# Altium schematic sheet Top.SchDoc: DEFAULT
size B; CheckedBy: CHECKER; Author: AUTHOR; Revision: A; SheetNumber: 1; SheetTotal: 11; PartNumber: 123
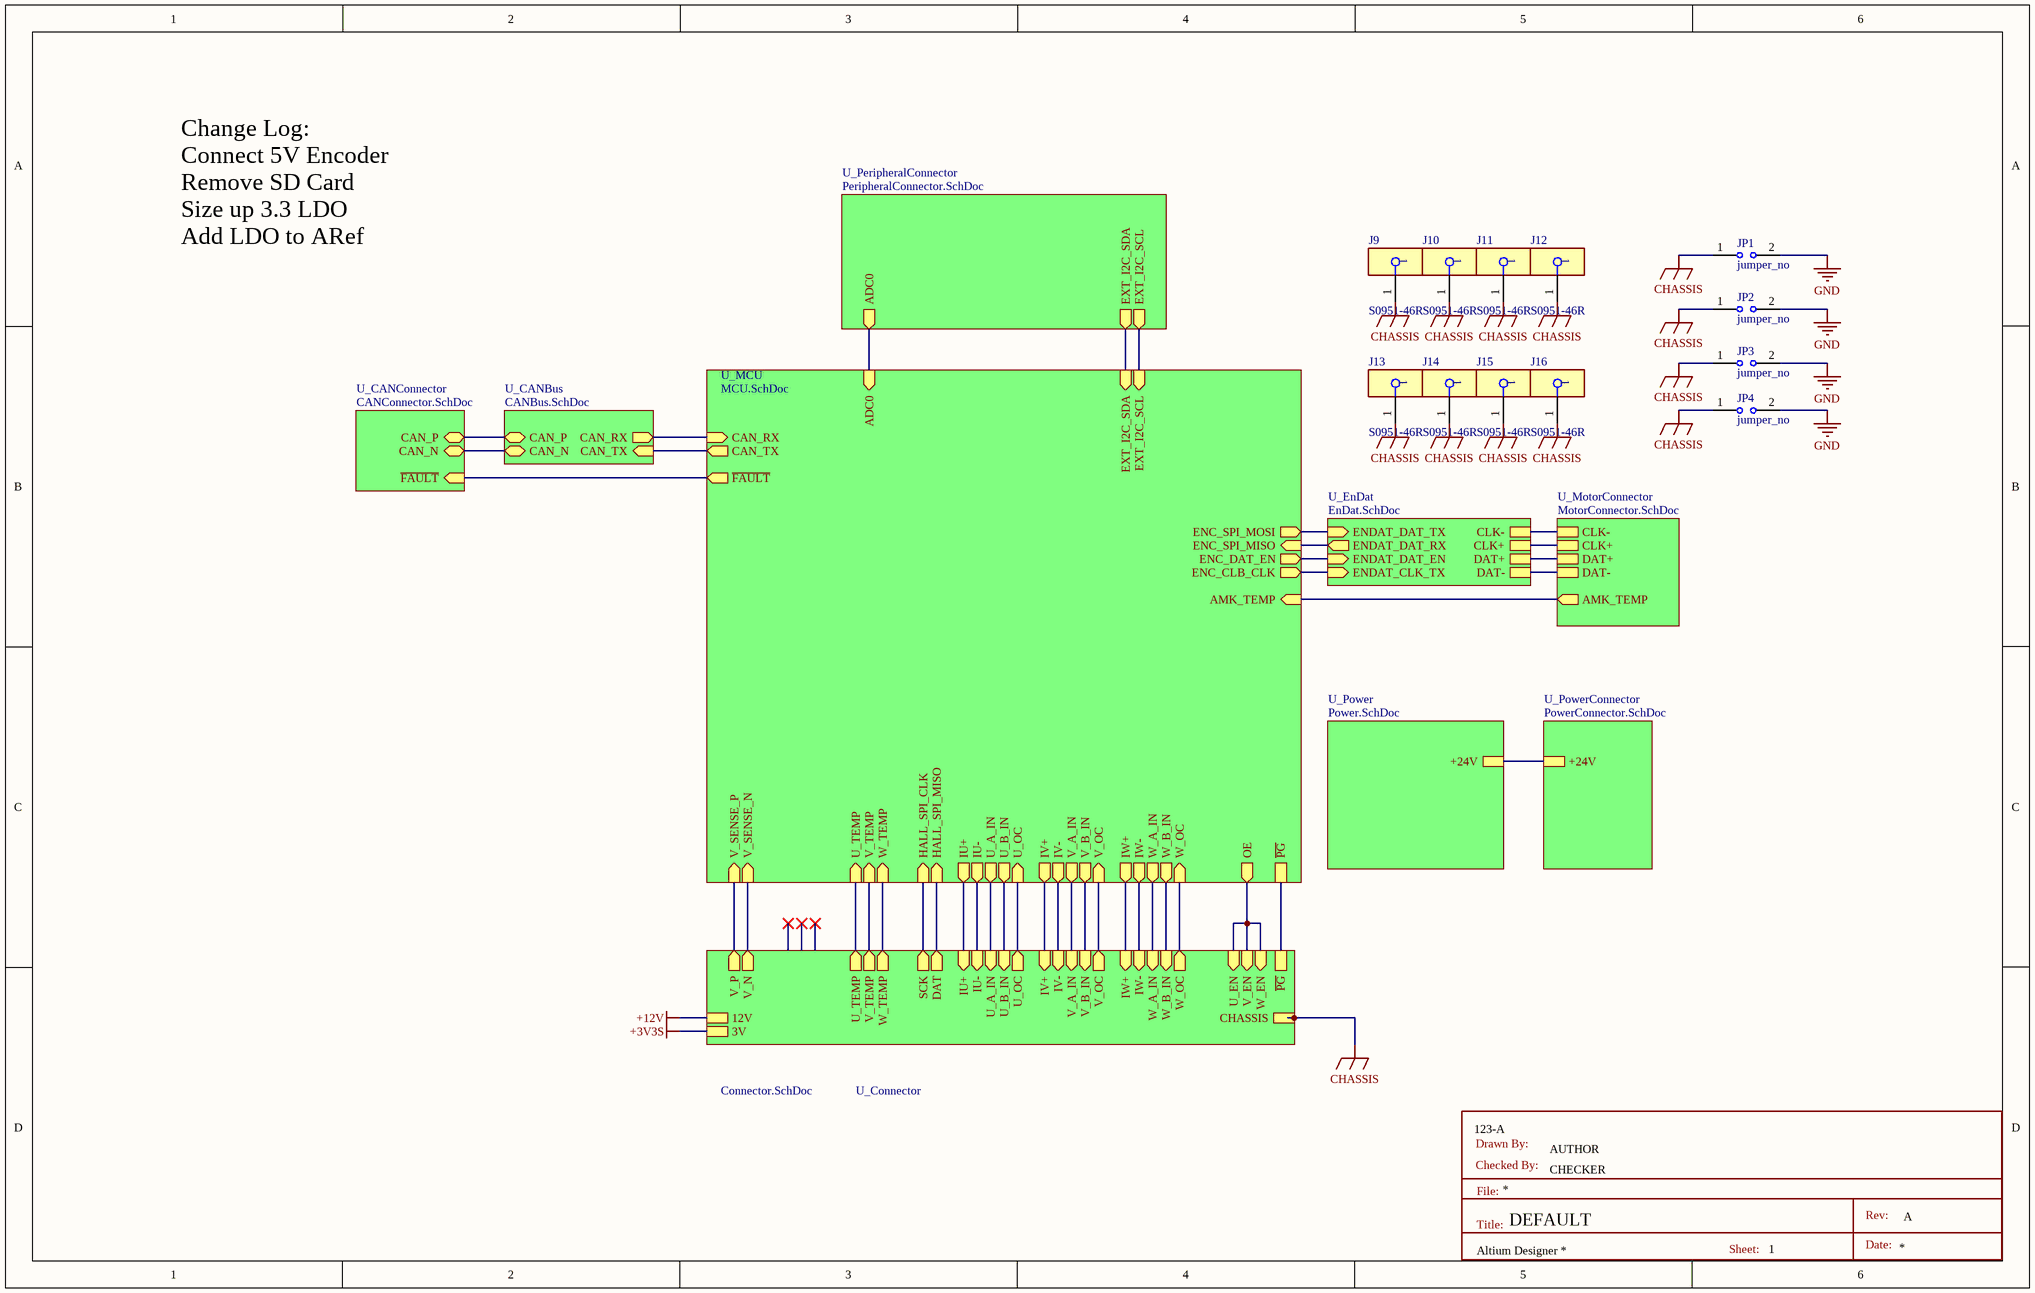
[diagram p0: Top.SchDoc]

## Parts
J9  S0951-46R  [FP-S0951-46R-MFG]
J10  S0951-46R  [FP-S0951-46R-MFG]
J11  S0951-46R  [FP-S0951-46R-MFG]
J12  S0951-46R  [FP-S0951-46R-MFG]
J13  S0951-46R  [FP-S0951-46R-MFG]
J14  S0951-46R  [FP-S0951-46R-MFG]
J15  S0951-46R  [FP-S0951-46R-MFG]
J16  S0951-46R  [FP-S0951-46R-MFG]
JP1  jumper_no  [jumper_no]
JP2  jumper_no  [jumper_no]
JP3  jumper_no  [jumper_no]
JP4  jumper_no  [jumper_no]

## Sub-sheets
U_CANBus = CANBus.SchDoc: CAN_TX (in), CAN_RX (out), CAN_P (bidir), CAN_N (bidir)
U_CANConnector = CANConnector.SchDoc: CAN_P (bidir), CAN_N (bidir), ~{FAULT} (in)
U_Connector = Connector.SchDoc: U_B_IN (in), U_A_IN (in), U_EN (in), U_OC (out), V_A_IN (in), V_B_IN (in), V_EN (in), V_OC (out), W_EN (in), W_OC (out), W_A_IN (in), W_B_IN (in), V_N (out), V_P (out), W_TEMP (out), V_TEMP (out), U_TEMP (out), 3V, 12V, CHASSIS, SCK (out), DAT (out), ~{PG}, IU+ (in), IU- (in), IV+ (in), IV- (in), IW+ (in), IW- (in)
U_EnDat = EnDat.SchDoc: CLK-, CLK+, DAT+, DAT-, ENDAT_DAT_RX (out), ENDAT_DAT_EN (in), ENDAT_DAT_TX (in), ENDAT_CLK_TX (in)
U_MCU = MCU.SchDoc: ENC_SPI_MOSI (out), ENC_SPI_MISO (in), HALL_SPI_MISO (in), HALL_SPI_CLK (in), EXT_I2C_SCL (in), EXT_I2C_SDA (in), CAN_RX (in), CAN_TX (out), V_A_IN (out), V_B_IN (out), V_OC (in), V_TEMP (in), U_A_IN (out), U_B_IN (out), U_OC (in), U_TEMP (in), W_A_IN (out), W_B_IN (out), W_OC (in), W_TEMP (in), AMK_TEMP (in), ENC_DAT_EN (out), ENC_CLB_CLK (out), V_SENSE_P (in), V_SENSE_N (in), OE (out), ~{FAULT} (out), ADC0 (in), ~{PG}, IU- (out), IW- (out), IU+ (out), IV+ (out), IW+ (out), IV- (out)
U_MotorConnector = MotorConnector.SchDoc: AMK_TEMP (out), CLK-, CLK+, DAT+, DAT-
U_PeripheralConnector = PeripheralConnector.SchDoc: EXT_I2C_SCL (out), EXT_I2C_SDA (out), ADC0 (out)
U_Power = Power.SchDoc: +24V
U_PowerConnector = PowerConnector.SchDoc: +24V

## Nets
+3V3S: sheet U_Connector/3V
+12V: sheet U_Connector/12V
CHASSIS: J9.1 J10.1 J11.1 J12.1 J13.1 J14.1 J15.1 J16.1 JP1.1 JP2.1 JP3.1 JP4.1 ; sheet U_Connector/CHASSIS
GND: JP1.2 JP2.2 JP3.2 JP4.2
(unnamed): sheet U_MCU/ENC_SPI_MOSI, sheet U_EnDat/ENDAT_DAT_TX
(unnamed): sheet U_MCU/ENC_SPI_MISO, sheet U_EnDat/ENDAT_DAT_RX
(unnamed): sheet U_MCU/HALL_SPI_MISO, sheet U_Connector/DAT
(unnamed): sheet U_MCU/HALL_SPI_CLK, sheet U_Connector/SCK
(unnamed): sheet U_MCU/EXT_I2C_SCL, sheet U_PeripheralConnector/EXT_I2C_SCL
(unnamed): sheet U_MCU/EXT_I2C_SDA, sheet U_PeripheralConnector/EXT_I2C_SDA
(unnamed): sheet U_MCU/CAN_RX, sheet U_CANBus/CAN_RX
(unnamed): sheet U_MCU/CAN_TX, sheet U_CANBus/CAN_TX
(unnamed): sheet U_MCU/V_A_IN, sheet U_Connector/V_A_IN
(unnamed): sheet U_MCU/V_B_IN, sheet U_Connector/V_B_IN
(unnamed): sheet U_MCU/V_OC, sheet U_Connector/V_OC
(unnamed): sheet U_MCU/V_TEMP, sheet U_Connector/V_TEMP
(unnamed): sheet U_MCU/U_A_IN, sheet U_Connector/U_A_IN
(unnamed): sheet U_MCU/U_B_IN, sheet U_Connector/U_B_IN
(unnamed): sheet U_MCU/U_OC, sheet U_Connector/U_OC
(unnamed): sheet U_MCU/U_TEMP, sheet U_Connector/U_TEMP
(unnamed): sheet U_MCU/W_A_IN, sheet U_Connector/W_A_IN
(unnamed): sheet U_MCU/W_B_IN, sheet U_Connector/W_B_IN
(unnamed): sheet U_MCU/W_OC, sheet U_Connector/W_OC
(unnamed): sheet U_MCU/W_TEMP, sheet U_Connector/W_TEMP
(unnamed): sheet U_MCU/AMK_TEMP, sheet U_MotorConnector/AMK_TEMP
(unnamed): sheet U_MCU/ENC_DAT_EN, sheet U_EnDat/ENDAT_DAT_EN
(unnamed): sheet U_MCU/ENC_CLB_CLK, sheet U_EnDat/ENDAT_CLK_TX
(unnamed): sheet U_MCU/V_SENSE_P, sheet U_Connector/V_P
(unnamed): sheet U_MCU/V_SENSE_N, sheet U_Connector/V_N
(unnamed): sheet U_MCU/OE, sheet U_Connector/U_EN, sheet U_Connector/V_EN, sheet U_Connector/W_EN
(unnamed): sheet U_MCU/~{FAULT}, sheet U_CANConnector/~{FAULT}
(unnamed): sheet U_MCU/ADC0, sheet U_PeripheralConnector/ADC0
(unnamed): sheet U_MCU/~{PG}, sheet U_Connector/~{PG}
(unnamed): sheet U_MCU/IU-, sheet U_Connector/IU-
(unnamed): sheet U_MCU/IW-, sheet U_Connector/IW-
(unnamed): sheet U_MCU/IU+, sheet U_Connector/IU+
(unnamed): sheet U_MCU/IV+, sheet U_Connector/IV+
(unnamed): sheet U_MCU/IW+, sheet U_Connector/IW+
(unnamed): sheet U_MCU/IV-, sheet U_Connector/IV-
(unnamed): sheet U_EnDat/CLK-, sheet U_MotorConnector/CLK-
(unnamed): sheet U_EnDat/CLK+, sheet U_MotorConnector/CLK+
(unnamed): sheet U_EnDat/DAT+, sheet U_MotorConnector/DAT+
(unnamed): sheet U_EnDat/DAT-, sheet U_MotorConnector/DAT-
(unnamed): sheet U_CANBus/CAN_P, sheet U_CANConnector/CAN_P
(unnamed): sheet U_CANBus/CAN_N, sheet U_CANConnector/CAN_N
(unnamed): sheet U_Power/+24V, sheet U_PowerConnector/+24V

## Notes on the sheet
- Change Log:
  Connect 5V Encoder
  Remove SD Card
  Size up 3.3 LDO
  Add LDO to ARef
- Drawn By:
- Checked By:
- File:
- Title:
- Sheet:
- Rev:
- Date:

## Library data of the parts
J9-J16 = CMP-15817-000012-1: RFI SHIELD CLIP MINI TIN SMD; Width: 0.04inch; Min Operating Temperature: -40°C; Max Operating Temperature: 185°C; Thickness: 0.051inch; REACH SVHC: No SVHC; Length: 0.155inch